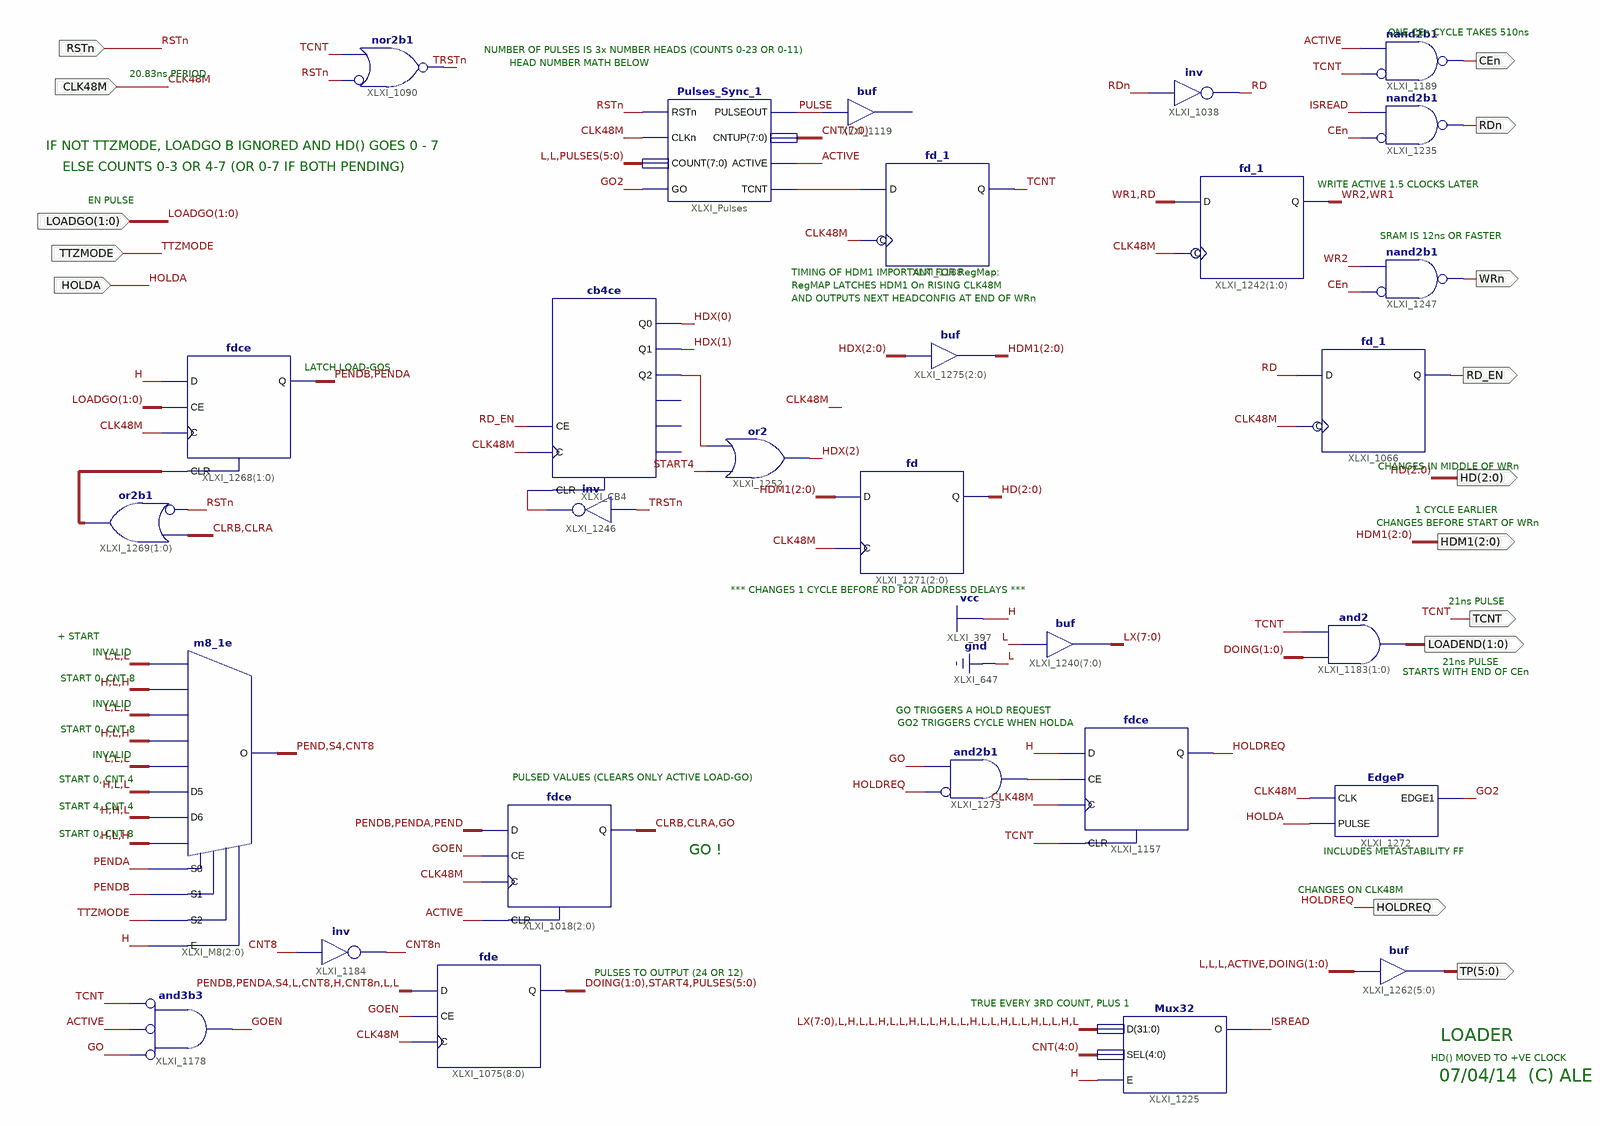
[diagram p0: schematic sheet 1]
// Xilinx ISE schematic Loader.sch (spartan3e) as structural Verilog: 29 symbols, 15 ports
module Loader (
  input  RSTn,
  input  CLK48M,
  input  [1:0] LOADGO,
  input  TTZMODE,
  input  HOLDA,
  output [2:0] HD,
  output TCNT,
  output RDn,
  output WRn,
  output [1:0] LOADEND,
  output CEn,
  output RD_EN,
  output [2:0] HDM1,
  output [5:0] TP,
  output HOLDREQ
);

  wire ACTIVE, CLRA, CLRB, CNT8, CNT8n, GO, GO2, GOEN, ISREAD, PEND, PENDA, PENDB, PULSE, RD, S4, START4,
       TRSTn, WR1, WR2, XLXN_454, XLXN_462, XLXN_566, XLXN_569;
  wire [1:0] DOING, XLXN_479;
  wire [2:0] HDX;
  wire [5:0] PULSES;
  wire [7:0] CNT, LX;

  fdce XLXI_1018[2:0] (.C(CLK48M), .CE(GOEN), .CLR(ACTIVE), .D({PENDB, PENDA, PEND}), .Q({CLRB, CLRA, GO}));
  m8_1e XLXI_M8[2:0] (
    .D0(3'b000), .D1(3'b101), .D2(3'b000), .D3(3'b101), .D4(3'b000), .D5(3'b100), .D6(3'b110), .D7(3'b101),
    .E(1'b1), .S0(PENDA), .S1(PENDB), .S2(TTZMODE), .O({PEND, S4, CNT8}));
  and XLXI_1178 (GOEN, ~GO, ~ACTIVE, ~TCNT);  // and3b3
  fde XLXI_1075[8:0] (
    .C(CLK48M), .CE(GOEN), .D({PENDB, PENDA, S4, 1'b0, CNT8, 1'b1, CNT8n, 2'b00}), .Q({DOING, START4, PULSES}));
  assign LOADEND = DOING & {2{TCNT}};  // and2 XLXI_1183[1..0], 2 bits wide
  not XLXI_1184 (CNT8n, CNT8);
  fd_1 XLXI_1066 (.C(CLK48M), .D(RD), .Q(RD_EN));
  not XLXI_1038 (RD, RDn);
  nand XLXI_1189 (CEn, ~TCNT, ACTIVE);  // nand2b1
  nand XLXI_1235 (RDn, ~CEn, ISREAD);  // nand2b1
  assign LX = {8{1'b0}};  // buf XLXI_1240[7..0], 8 bits wide
  fd_1 XLXI_1242[1:0] (.C(CLK48M), .D({WR1, RD}), .Q({WR2, WR1}));
  nand XLXI_1247 (WRn, ~CEn, WR2);  // nand2b1
  assign TP = {3'b000, ACTIVE, DOING};  // buf XLXI_1262[5..0], 6 bits wide
  Mux32 XLXI_1225 (.D({LX, 24'b010010010010010010010010}), .E(1'b1), .O(ISREAD), .SEL(CNT[4:0]));
  assign XLXN_479 = ~{2{RSTn}} | {CLRB, CLRA};  // or2b1 XLXI_1269[1..0], 2 bits wide
  fdce XLXI_1268[1:0] (.C(CLK48M), .CE(LOADGO), .CLR(XLXN_479), .D(1'b1), .Q({PENDB, PENDA}));
  fd XLXI_1271[2:0] (.C(CLK48M), .D(HDM1), .Q(HD));
  not XLXI_1246 (XLXN_454, TRSTn);
  or XLXI_1252 (HDX[2], START4, XLXN_462);
  cb4ce XLXI_CB4 (
    .C(CLK48M), .CE(RD_EN), .CLR(XLXN_454), .Q0(HDX[0]), .Q1(HDX[1]), .Q2(XLXN_462));  // open: CEO, Q3, TC
  nor XLXI_1090 (TRSTn, ~RSTn, TCNT);  // nor2b1
  // buf XLXI_1119 has open pins: I=PULSE, O=open
  Pulses_Sync_1 XLXI_Pulses (
    .ACTIVE(ACTIVE), .CLKn(CLK48M), .CNTUP(CNT), .COUNT({2'b00, PULSES}), .GO(GO2), .PULSEOUT(PULSE),
    .RSTn(RSTn), .TCNT(XLXN_566));
  fd_1 XLXI_1188 (.C(CLK48M), .D(XLXN_566), .Q(TCNT));
  fdce XLXI_1157 (.C(CLK48M), .CE(XLXN_569), .CLR(TCNT), .D(1'b1), .Q(HOLDREQ));
  EdgeP XLXI_1272 (.CLK(CLK48M), .EDGE1(GO2), .PULSE(HOLDA));
  and XLXI_1273 (XLXN_569, ~HOLDREQ, GO);  // and2b1
  assign HDM1 = HDX;  // buf XLXI_1275[2..0], 3 bits wide

  // Notes on the sheet:
  //   ONE CEn CYCLE TAKES 510ns
  //   NUMBER OF PULSES IS 3x NUMBER HEADS (COUNTS 0-23 OR 0-11)
  //   HEAD NUMBER MATH BELOW
  //   20.83ns PERIOD
  //   IF NOT TTZMODE, LOADGO B IGNORED AND HD() GOES 0 - 7
  //   ELSE COUNTS 0-3 OR 4-7 (OR 0-7 IF BOTH PENDING)
  //   WRITE ACTIVE 1.5 CLOCKS LATER
  //   EN PULSE
  //   SRAM IS 12ns OR FASTER
  //   TIMING OF HDM1 IMPORTANT FOR RegMap:
  //   RegMAP LATCHES HDM1 On RISING CLK48M
  //   AND OUTPUTS NEXT HEADCONFIG AT END OF WRn
  //   LATCH LOAD-GOS
  //   CHANGES IN MIDDLE OF WRn
  //   1 CYCLE EARLIER
  //   CHANGES BEFORE START OF WRn
  //   *** CHANGES 1 CYCLE BEFORE RD FOR ADDRESS DELAYS ***
  //   21ns PULSE
  //   + START
  //   INVALID
  //   21ns PULSE
  //   STARTS WITH END OF CEn
  //   START 0, CNT 8
  //   INVALID
  //   GO TRIGGERS A HOLD REQUEST
  //   GO2 TRIGGERS CYCLE WHEN HOLDA
  //   START 0, CNT 8
  //   INVALID
  //   PULSED VALUES (CLEARS ONLY ACTIVE LOAD-GO)
  //   START 0, CNT 4
  //   START 4, CNT 4
  //   START 0, CNT 8
  //   GO !
  //   INCLUDES METASTABILITY FF
  //   CHANGES ON CLK48M
  //   PULSES TO OUTPUT (24 OR 12)
  //   TRUE EVERY 3RD COUNT, PLUS 1
  //   LOADER
  //   HD() MOVED TO +VE CLOCK
  //   07/04/14  (C) ALE
endmodule
